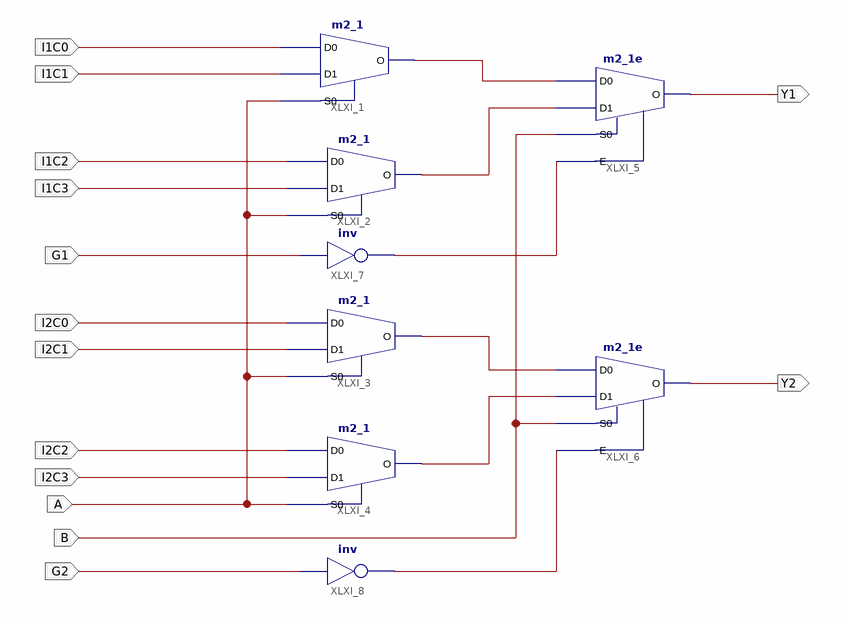
[diagram p0: schematic sheet 1]
// Xilinx ISE schematic X74_153.sch (spartan3e) as structural Verilog: 8 symbols, 14 ports
module X74_153 (
  input  I1C0,
  input  I1C1,
  input  I1C2,
  input  I1C3,
  input  G1,
  input  I2C0,
  input  I2C1,
  input  I2C2,
  input  I2C3,
  input  G2,
  input  A,
  input  B,
  output Y1,
  output Y2
);

  wire XLXN_1, XLXN_2, XLXN_13, XLXN_14, XLXN_15, XLXN_22;

  m2_1 XLXI_1 (.D0(I1C0), .D1(I1C1), .S0(A), .O(XLXN_1));
  m2_1 XLXI_2 (.D0(I1C2), .D1(I1C3), .S0(A), .O(XLXN_2));
  m2_1 XLXI_3 (.D0(I2C0), .D1(I2C1), .S0(A), .O(XLXN_13));
  m2_1 XLXI_4 (.D0(I2C2), .D1(I2C3), .S0(A), .O(XLXN_14));
  m2_1e XLXI_5 (.D0(XLXN_1), .D1(XLXN_2), .E(XLXN_22), .S0(B), .O(Y1));
  m2_1e XLXI_6 (.D0(XLXN_13), .D1(XLXN_14), .E(XLXN_15), .S0(B), .O(Y2));
  not XLXI_7 (XLXN_22, G1);
  not XLXI_8 (XLXN_15, G2);
endmodule
